# Altium schematic sheet Controller_Board_Interface.SchDoc: Controller Board Interface
size B; Organization: Midnight Sun Solar Rayce Car Team; Address1: University of Waterloo; Address2: 200 University Ave W; Address3: Waterloo, ON, Canada; Address4: N2L 3E9; Website: www.uwmidsun.com; ProjectName: ProjectName
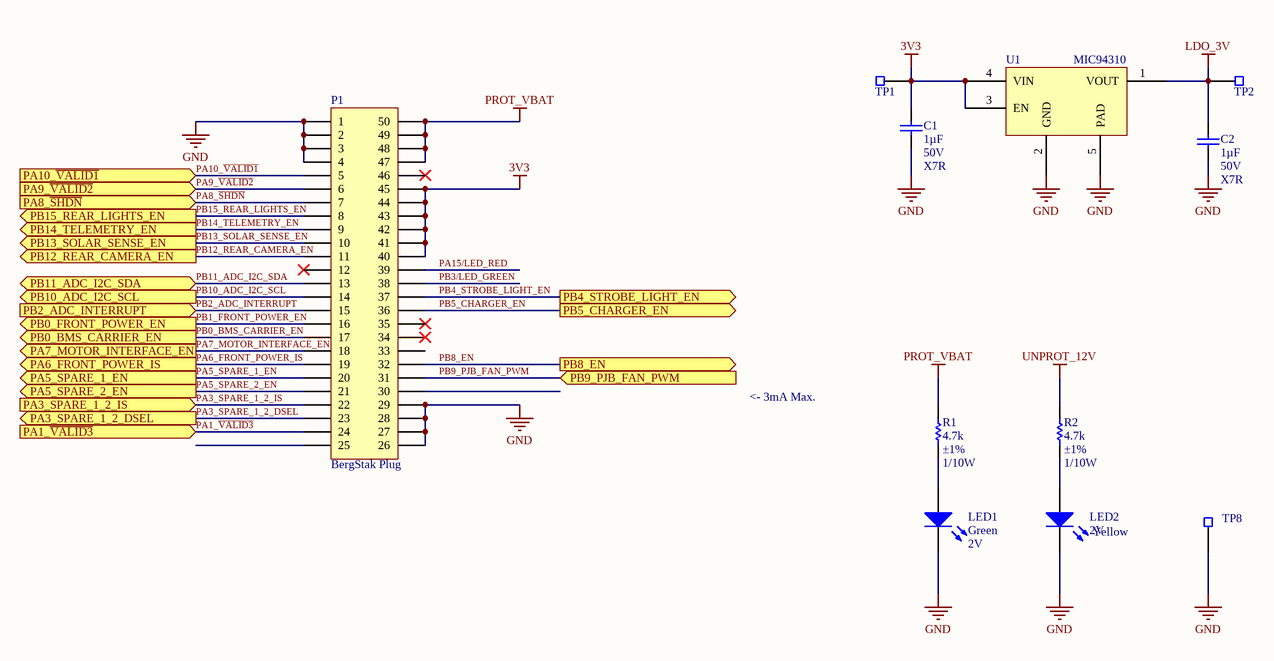
[diagram p0: Controller_Board_Interface.SchDoc]

## Parts
C1  Capacitance: 1µF  Voltage: 50V  Temperature Coefficient: X7R  [CAP, 0603]  (hidden comment: CAP CER 1UF 50V 10% X7R 0603)
C2  Capacitance: 1µF  Voltage: 50V  Temperature Coefficient: X7R  [CAP, 0603]  (hidden comment: CAP CER 1UF 50V 10% X7R 0603)
LED1  Color: Green  Voltage - Forward (Vf) (Typ): 2V  [LED_0603]  (hidden comment: LED GREEN CLEAR 2V 0603)
LED2  Voltage - Forward (Vf) (Typ): 2V  [LED_0603]  (hidden comment: LED YELLOW CLEAR 2.1V 0603)
P1  Series: BergStak Plug  [CONN, Bergstak 50 Pos Plug]  (hidden comment: CONN 50POS Bergstak Plug 0.02")
R1  Resistance (Ohms): 4.7k  Tolerance: ±1%  Power (Watts): 1/10W  [RES, 0603]  (hidden comment: RES 4.7K OHM 1% 1/10W 0603)
R2  Resistance (Ohms): 4.7k  Tolerance: ±1%  Power (Watts): 1/10W  [RES, 0603]  (hidden comment: RES 4.7K OHM 1% 1/10W 0603)
TP1  Test Point 0603 SMD  [TEST POINT 0603 SMD]  (value not drawn)
TP2  Test Point 0603 SMD  [TEST POINT 0603 SMD]  (value not drawn)
TP8  Test Point 0603 SMD  [TEST POINT 0603 SMD]  (value not drawn)
U1  Manufacturer Part Number: MIC94310  [IC REG LDO 3V 0.2A 4-TDFN]  (hidden comment: IC REG LDO 3V 0.2A 4-TDFN)

## Ports
PA1_~{VALID3} (in), PA3_SPARE_1_2_DSEL (out), PA3_SPARE_1_2_IS (in), PA5_SPARE_1_EN (out), PA5_SPARE_2_EN (out), PA6_FRONT_POWER_IS (out), PA7_MOTOR_INTERFACE_EN (out), PA8_~{SHDN} (in), PA9_~{VALID2} (in), PA10_~{VALID1} (in), PB0_BMS_CARRIER_EN (out), PB0_FRONT_POWER_EN (out), PB2_ADC_INTERRUPT (in), PB4_STROBE_LIGHT_EN (out), PB5_CHARGER_EN (out), PB8_EN (out), PB9_PJB_FAN_PWM (in), PB10_ADC_I2C_SCL (out), PB11_ADC_I2C_SDA (bidir), PB12_REAR_CAMERA_EN (out), PB13_SOLAR_SENSE_EN (out), PB14_TELEMETRY_EN (out), PB15_REAR_LIGHTS_EN (out)

## Nets
3V3: C1.1 P1.40 P1.41 P1.42 P1.43 P1.44 P1.45 TP1.1 U1.3(EN) U1.4(VIN)
GND: C1.2 C2.2 LED1.2(K) LED2.2(K) P1.1 P1.2 P1.3 P1.4 P1.26 P1.27 P1.28 P1.29 TP8.1 U1.2(GND) U1.5(PAD)
LDO_3V: C2.1 TP2.1 U1.1(VOUT)
PROT_VBAT: P1.47 P1.48 P1.49 P1.50 R1.1
UNPROT_12V: R2.1
PA1_~{VALID3}: P1.24 ; port PA1_~{VALID3}
PA3_SPARE_1_2_DSEL: P1.23 ; port PA3_SPARE_1_2_DSEL
PA3_SPARE_1_2_IS: P1.22 ; port PA3_SPARE_1_2_IS
PA5_SPARE_1_EN: P1.20 ; port PA5_SPARE_1_EN
PA5_SPARE_2_EN: P1.21 ; port PA5_SPARE_2_EN
PA6_FRONT_POWER_IS: P1.19 ; port PA6_FRONT_POWER_IS
PA7_MOTOR_INTERFACE_EN: P1.18 ; port PA7_MOTOR_INTERFACE_EN
PA8_~{SHDN}: P1.7 ; port PA8_~{SHDN}
PA9_~{VALID2}: P1.6 ; port PA9_~{VALID2}
PA10_~{VALID1}: P1.5 ; port PA10_~{VALID1}
PA15/LED_RED: P1.39
PB0_BMS_CARRIER_EN: P1.17 ; port PB0_BMS_CARRIER_EN
PB1_FRONT_POWER_EN: P1.16 ; port PB0_FRONT_POWER_EN
PB2_ADC_INTERRUPT: P1.15 ; port PB2_ADC_INTERRUPT
PB3/LED_GREEN: P1.38
PB4_STROBE_LIGHT_EN: P1.37 ; port PB4_STROBE_LIGHT_EN
PB5_CHARGER_EN: P1.36 ; port PB5_CHARGER_EN
PB8_EN: P1.32 ; port PB8_EN
PB9_PJB_FAN_PWM: P1.31 ; port PB9_PJB_FAN_PWM
PB10_ADC_I2C_SCL: P1.14 ; port PB10_ADC_I2C_SCL
PB11_ADC_I2C_SDA: P1.13 ; port PB11_ADC_I2C_SDA
PB12_REAR_CAMERA_EN: P1.11 ; port PB12_REAR_CAMERA_EN
PB13_SOLAR_SENSE_EN: P1.10 ; port PB13_SOLAR_SENSE_EN
PB14_TELEMETRY_EN: P1.9 ; port PB14_TELEMETRY_EN
PB15_REAR_LIGHTS_EN: P1.8 ; port PB15_REAR_LIGHTS_EN
NetLED1_1: LED1.1(A) R1.2
NetLED2_1: LED2.1(A) R2.2

Not connected (* = marked no-connect by the designer): P1 12* 25 30 33 34* 35* 46*

## Notes on the sheet
- <- 3mA Max.
- (near LED2) Yellow
- PROJECT
- DOCUMENT
- DRAWN BY
- LAST MODIFIED
- PART NUMBER
- REVISION
- SHEET
- VARIANT
- OF
- Engineering 5 - 1002
  University of Waterloo
  (519) 888-4567 x32978
  hardware@uwmidsun.com

## Library data of the parts
C1 C2 = CAP CER 1UF 50V 10% X7R 0603: 1µF ±10% 50V Ceramic Capacitor X7R 0603 (1608 Metric); Manufacturer 1: Taiyo Yuden; Manufacturer Part Number 1: UMK107AB7105KA-T; Supplier 1: Digi-Key; Supplier Part Number 1: 587-3247-1-ND; Packaging: Cut Tape (CT); Part Status: Active; Operating Temperature: -55°C ~ 125°C; Ratings: -; Mounting Type: Surface Mount, MLCC; Package / Case: 0603 (1608 Metric); Size / Dimension: 0.063" L x 0.031" W (1.60mm x 0.80mm); Height - Seated (Max): -; Thickness (Max): 0.037" (0.95mm); Lead Spacing: -; Lead Style: -; ComponentLink1URL: http://www.yuden.co.jp/productdata/catalog/en/mlcc_all_e.pdf; ComponentLink1Description: http://www.yuden.co.jp/productdata/catalog/en/mlcc_all_e.pdf; Tolerance: ±10%
LED1 = LED GREEN CLEAR 2V 0603: Green 572nm LED Indication - Discrete 2V 0603 (1608 Metric); Manufacturer: Wurth Electronics Inc.; Manufacturer Part Number: 150060VS75000; Lens Color: Colorless; Millicandela Rating: 40mcd; Lens Style/Size: Rectangle with Flat Top, 1.10mm x 0.70mm; Current - Test: 20mA; Viewing Angle: 140°; Wavelength - Dominant: 570nm; Supplier 1: Digi-Key; Supplier Part Number 1: 732-4980-1-ND; Packaging: Cut Tape (CT); Part Status: Active; Lens Transparency: Clear; Mounting Type: Surface Mount; Wavelength - Peak: 572nm; Package / Case: 0603 (1608 Metric); Supplier Device Package: 0603; Size / Dimension: 1.60mm L x 0.80mm W; Height (Max): 0.80mm; ComponentLink1URL: http://katalog.we-online.de/led/datasheet/150060VS75000.pdf; ComponentLink1Description: http://katalog.we-online.de/led/datasheet/150060VS75000.pdf; Category: Optoelectronics; Features: -; Pricing 1: 1=0.21, 100=0.1617, 500=0.13964 (CAD); RoHS: RoHS Compliant; Stock 1: 9408
LED2 = LED YELLOW CLEAR 2.1V 0603: Yellow 590nm LED Indication - Discrete 2V 0603 (1608 Metric); Manufacturer: Wurth Electronics Inc.; Manufacturer Part Number: 150060YS75000; Lens Color: Colorless; Millicandela Rating: 120mcd; Lens Style/Size: Rectangle with Flat Top, 1.10mm x 0.70mm; Current - Test: 20mA; Viewing Angle: 140°; Wavelength - Peak: 595nm; Supplier 1: Digi-Key; Supplier Part Number 1: 732-4981-1-ND; RoHS: RoHS Compliant; Category: Optoelectronics; Stock 1: 10523; Pricing 1: 1=0.21, 100=0.1617, 500=0.13964 (CAD); Packaging: Cut Tape (CT); Part Status: Active; Color: Yellow; Lens Transparency: Clear; Mounting Type: Surface Mount; Wavelength - Dominant: 590nm; Features: -; Package / Case: 0603 (1608 Metric); Size / Dimension: 1.60mm L x 0.80mm W; Height (Max): 0.80mm; ComponentLink1URL: http://katalog.we-online.de/led/datasheet/150060YS75000.pdf; ComponentLink1Description: http://katalog.we-online.de/led/datasheet/150060YS75000.pdf; Supplier Device Package: 0603
P1 = CONN 50POS Bergstak Plug 0.02": 50 Position Connector Plug, Outer Shroud Contacts Surface Mount Gold; Manufacturer 1: Amphenol FCI; Manufacturer Part Number 1: 10132797-055100LF; Number of Positions: 50; Mated Stacking Heights: 5mm; Pitch: 0.020" (0.50mm); Supplier 1: Digi-Key; Supplier Part Number 1: 609-5226-1-ND; Packaging: Cut Tape (CT); Part Status: Active; Connector Type: Plug, Outer Shroud Contacts; Number of Rows: 2; Mounting Type: Surface Mount; Contact Finish: Gold; Contact Finish Thickness: 1µin (0.025µm); Height Above Board: 0.169" (4.30mm); ComponentLink1URL: http://portal.fciconnect.com/Comergent//fci/drawing/10132797.pdf; ComponentLink1Description: http://portal.fciconnect.com/Comergent//fci/drawing/10132797.pdf
R1 R2 = RES 4.7K OHM 1% 1/10W 0603: 4.7k Ohm ±1% 0.1W, 1/10W Chip Resistor 0603 (1608 Metric) Moisture Resistant Thick Film; Manufacturer 1: Yageo; Manufacturer Part Number 1: RC0603FR-074K7L; Description 1: RES SMD 4.7K OHM 1% 1/10W 0603; Temperature Coefficient: ±100ppm/°C; Supplier 1: Digi-Key; Supplier Part Number 1: 311-4.70KHRCT-ND; RoHS: RoHS Compliant; Category: Resistors; Stock 1: 3487566; Pricing 1: 1=0.16, 10=0.022, 100=0.0089, 1000=0.00402, 2500=0.00349 (CAD); Packaging: Cut Tape (CT); Part Status: Active; Composition: Thick Film; Features: Moisture Resistant; Operating Temperature: -55°C ~ 155°C; Package / Case: 0603 (1608 Metric); Supplier Device Package: 0603; Size / Dimension: 0.063" L x 0.031" W (1.60mm x 0.80mm); Height - Seated (Max): 0.022" (0.55mm); Failure Rate: -; ComponentLink1URL: http://www.yageo.com/documents/recent/PYu-RC_Group_51_RoHS_L_7.pdf; ComponentLink1Description: http://www.yageo.com/documents/recent/PYu-RC_Group_51_RoHS_L_7.pdf
TP1 TP2 TP8 = Test Point 0603 SMD: Manufacturer 1: TE Connectivity; Manufacturer Part Number 1: 1625854-3; Description 1: Thick Film Resistors - SMD 2000; Resistance: 0mR; Supplier 1: Digi-Key; Supplier Part Number 1: A106145CT-ND; Stock 1: 212628; Pricing 1: 1=0.22, 10=0.211, 25=0.18, 50=0.1574, 100=0.1462, 250=0.12932, 500=0.12368, 1000=0.1012 (USD); Mount: Surface Mount; Case/Package: 0603; Colour: Natural; Case Code (Imperial): 0603; Case Code (Metric): 1608; Min Operating Temperature: -55°C; Max Operating Temperature: 125°C; Packaging: Tape and Reel; Termination: SMD/SMT; Package Quantity: 2000; Military Standard: Not; Length: 1.6mm; Height: 1.15mm; Width: 0.8mm; Depth: 0.8mm; Radiation Hardening: No; ComponentLink1URL: https://datasheet.ciiva.com/30100/1773266-a-30100967.pdf; ComponentLink1Description: https://datasheet.ciiva.com/30100/1773266-a-30100967.pdf; ComponentLink2URL: https://datasheet.ciiva.com/8914/eng-ds-1773266-a-8914634.pdf; ComponentLink2Description: https://datasheet.ciiva.com/8914/eng-ds-1773266-a-8914634.pdf; ComponentLink3URL: https://datasheet.ciiva.com/6439/eng-ds-1773266-a-6439163.pdf; ComponentLink3Description: https://datasheet.ciiva.com/6439/eng-ds-1773266-a-6439163.pdf; ComponentLink4URL: https://datasheet.ciiva.com/6439/eng-ds-1773266-a-6439164.pdf; ComponentLink4Description: https://datasheet.ciiva.com/6439/eng-ds-1773266-a-6439164.pdf; ComponentLink5URL: https://datasheet.ciiva.com/6439/eng-ds-1773266-a-6439165.pdf; ComponentLink5Description: https://datasheet.ciiva.com/6439/eng-ds-1773266-a-6439165.pdf
U1 = IC REG LDO 3V 0.2A 4-TDFN: Manufacturer: Microchip Technology; Regulator Topology: Positive Fixed; Current - Output: 200mA; Voltage - Dropout (Typical): 0.04V @ 200mA; Voltage - Input: Up to 3.6V; Current - Limit (Min): 250mA; Supplier 1: Digi-Key; RoHS: RoHS Compliant; Category: Integrated Circuits (ICs); Stock 1: 4802; Pricing 1: 1=0.45, 25=0.3708, 100=0.3386 (CAD); Packaging: Cut Tape (CT); Part Status: Active; Voltage - Output: 3V; Operating Temperature: -40°C ~ 125°C; Mounting Type: Surface Mount; Package / Case: 4-UFDFN Exposed Pad; Supplier Device Package: 4-TDFN (1.2x1.6); ComponentLink1URL: http://www.microchip.com/mymicrochip/filehandler.aspx?ddocname=en580409; ComponentLink1Description: http://www.microchip.com/mymicrochip/filehandler.aspx?ddocname=en580409; Supplier Part Number 1: 576-4761-1-ND